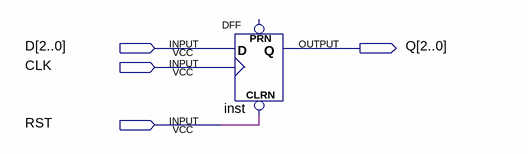
[diagram p0: schematic sheet]
// Quartus schematic CURRENTSTATE.bdf as structural Verilog: 1 symbols, 4 pins
module CURRENTSTATE (
  input  [2:0] D,
  input  CLK,
  input  RST,
  output [2:0] Q
);

  DFF inst[2:0] (.CLRN(RST), .CLK(CLK), .D(D), .Q(Q));  // open: PRN
endmodule
